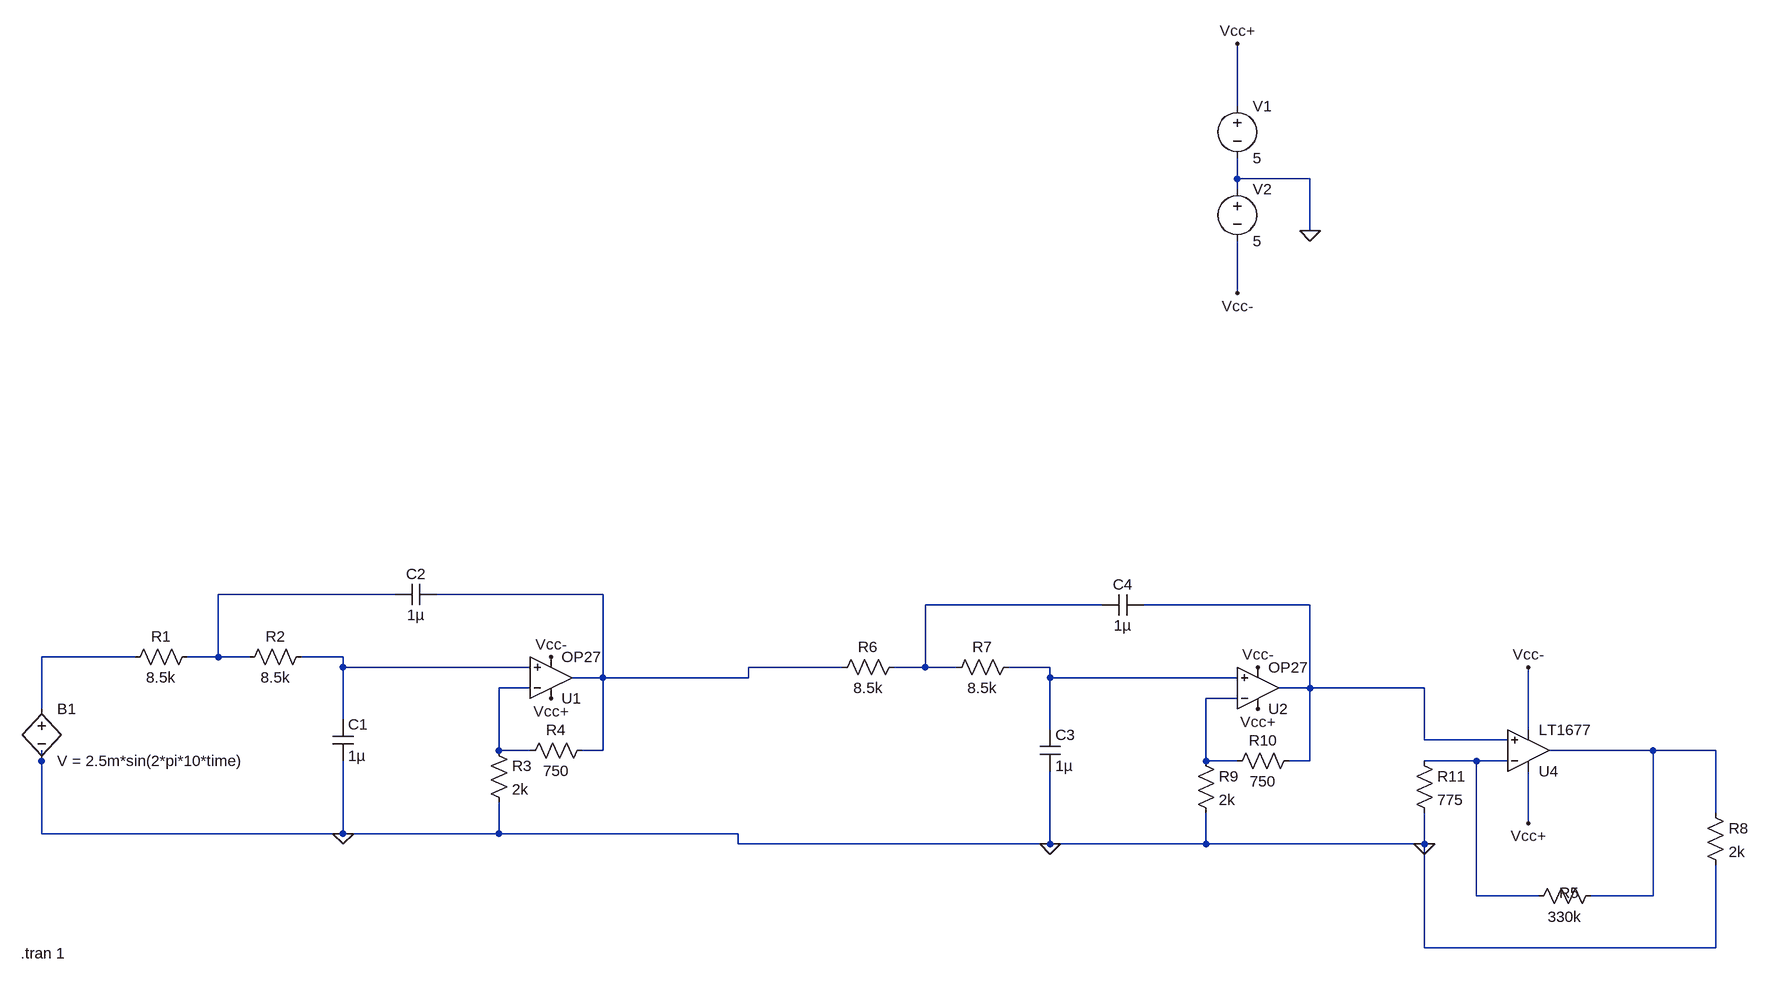
[diagram p0: schematic LowPass+640xamplify.asc]
LowPass+640xamplify.asc, the LTspice schematic file:
Version 4.1
SHEET 1 1480 1224
WIRE 688 -96 688 -192
WIRE 688 16 688 -16
WIRE 800 16 688 16
WIRE 688 32 688 16
WIRE 800 96 800 16
WIRE 688 192 688 112
WIRE -608 656 -880 656
WIRE -288 656 -544 656
WIRE 480 672 208 672
WIRE 800 672 544 672
WIRE -1008 752 -1152 752
WIRE -880 752 -880 656
WIRE -880 752 -928 752
WIRE -832 752 -880 752
WIRE -688 752 -752 752
WIRE -688 768 -688 752
WIRE -400 768 -688 768
WIRE 80 768 -64 768
WIRE 208 768 208 672
WIRE 208 768 160 768
WIRE 256 768 208 768
WIRE 400 768 336 768
WIRE -288 784 -288 656
WIRE -288 784 -336 784
WIRE -64 784 -64 768
WIRE -64 784 -288 784
WIRE 400 784 400 768
WIRE 688 784 400 784
WIRE -400 800 -448 800
WIRE 800 800 800 672
WIRE 800 800 752 800
WIRE 976 800 800 800
WIRE 688 816 640 816
WIRE -1152 832 -1152 752
WIRE -688 848 -688 768
WIRE 400 864 400 784
WIRE 1136 864 1136 768
WIRE 976 880 976 800
WIRE 1104 880 976 880
WIRE -448 896 -448 800
WIRE -400 896 -448 896
WIRE -288 896 -288 784
WIRE -288 896 -320 896
WIRE 1328 896 1168 896
WIRE 1424 896 1328 896
WIRE -1152 912 -1152 896
WIRE 640 912 640 816
WIRE 688 912 640 912
WIRE 800 912 800 800
WIRE 800 912 768 912
WIRE 1056 912 976 912
WIRE 1104 912 1056 912
WIRE 1424 992 1424 896
WIRE 1136 1008 1136 928
WIRE -1152 1024 -1152 912
WIRE -688 1024 -688 912
WIRE -688 1024 -1152 1024
WIRE -448 1024 -448 976
WIRE -448 1024 -688 1024
WIRE -80 1024 -448 1024
WIRE -80 1040 -80 1024
WIRE 400 1040 400 928
WIRE 400 1040 -80 1040
WIRE 640 1040 640 992
WIRE 640 1040 400 1040
WIRE 976 1040 976 992
WIRE 976 1040 640 1040
WIRE 1056 1120 1056 912
WIRE 1152 1120 1056 1120
WIRE 1328 1120 1328 896
WIRE 1328 1120 1232 1120
WIRE 976 1200 976 1040
WIRE 1424 1200 1424 1072
WIRE 1424 1200 976 1200
FLAG 800 96 0
FLAG 688 192 Vcc-
FLAG -368 752 Vcc-
FLAG -368 816 Vcc+
FLAG 688 -192 Vcc+
FLAG -688 1024 0
FLAG 720 768 Vcc-
FLAG 720 832 Vcc+
FLAG 400 1040 0
FLAG 1136 1008 Vcc+
FLAG 1136 768 Vcc-
FLAG 976 1040 0
SYMBOL OpAmps\\OP27 -368 848 M180
SYMATTR InstName U1
SYMBOL res -912 736 R90
WINDOW 0 0 56 VBottom 2
WINDOW 3 32 56 VTop 2
SYMATTR InstName R1
SYMATTR Value 8.5k
SYMBOL res -736 736 R90
WINDOW 0 0 56 VBottom 2
WINDOW 3 32 56 VTop 2
SYMATTR InstName R2
SYMATTR Value 8.5k
SYMBOL cap -704 848 R0
SYMATTR InstName C1
SYMATTR Value 1µ
SYMBOL cap -544 640 R90
WINDOW 0 0 32 VBottom 2
WINDOW 3 32 32 VTop 2
SYMATTR InstName C2
SYMATTR Value 1µ
SYMBOL voltage 688 -112 R0
SYMATTR InstName V1
SYMATTR Value 5
SYMBOL voltage 688 16 R0
SYMATTR InstName V2
SYMATTR Value 5
SYMBOL res -464 880 R0
SYMATTR InstName R3
SYMATTR Value 2k
SYMBOL res -304 880 R90
WINDOW 0 0 56 VBottom 2
WINDOW 3 32 56 VTop 2
SYMATTR InstName R4
SYMATTR Value 750
SYMBOL OpAmps\\OP27 720 864 M180
SYMATTR InstName U2
SYMBOL res 176 752 R90
WINDOW 0 0 56 VBottom 2
WINDOW 3 32 56 VTop 2
SYMATTR InstName R6
SYMATTR Value 8.5k
SYMBOL res 352 752 R90
WINDOW 0 0 56 VBottom 2
WINDOW 3 32 56 VTop 2
SYMATTR InstName R7
SYMATTR Value 8.5k
SYMBOL cap 384 864 R0
SYMATTR InstName C3
SYMATTR Value 1µ
SYMBOL cap 544 656 R90
WINDOW 0 0 32 VBottom 2
WINDOW 3 32 32 VTop 2
SYMATTR InstName C4
SYMATTR Value 1µ
SYMBOL res 624 896 R0
SYMATTR InstName R9
SYMATTR Value 2k
SYMBOL res 784 896 R90
WINDOW 0 0 56 VBottom 2
WINDOW 3 32 56 VTop 2
SYMATTR InstName R10
SYMATTR Value 750
SYMBOL OpAmps\\LT1677 1136 960 M180
SYMATTR InstName U4
SYMBOL res 1248 1104 R90
WINDOW 0 27 49 VBottom 2
WINDOW 3 32 56 VTop 2
SYMATTR InstName R5
SYMATTR Value 330k
SYMBOL res 960 896 R0
SYMATTR InstName R11
SYMATTR Value 775
SYMBOL res 1408 976 R0
SYMATTR InstName R8
SYMATTR Value 2k
SYMBOL bv -1152 816 R0
SYMATTR InstName B1
SYMATTR Value V = 2.5m*sin(2*pi*10*time)
TEXT -1184 1208 Left 2 !.tran 1

The netlist it stands for:
* LowPass+640xamplify.asc
X§U1 N006 N008 Vcc+ Vcc- N002 OP27  ; pins In+ In- V+ V- OUT
R1 N001 N005 8.5k
R2 N006 N001 8.5k
C1 N006 0 1µ
C2 N002 N001 1µ
V1 Vcc+ 0 5
V2 0 Vcc- 5
R3 N008 0 2k
R4 N002 N008 750
X§U2 N007 N009 Vcc+ Vcc- N004 OP27  ; pins In+ In- V+ V- OUT
R6 N003 N002 8.5k
R7 N007 N003 8.5k
C3 N007 0 1µ
C4 N004 N003 1µ
R9 N009 0 2k
R10 N004 N009 750
X§U4 N004 N011 Vcc+ Vcc- N010 LT1677  ; pins In+ In- V+ V- OUT
R5 N010 N011 330k
R11 N011 0 775
R8 N010 0 2k
B1 N005 0 V = 2.5m*sin(2*pi*10*time)
.tran 1
.lib ADI.lib
.lib LTC.lib
.backanno
.end